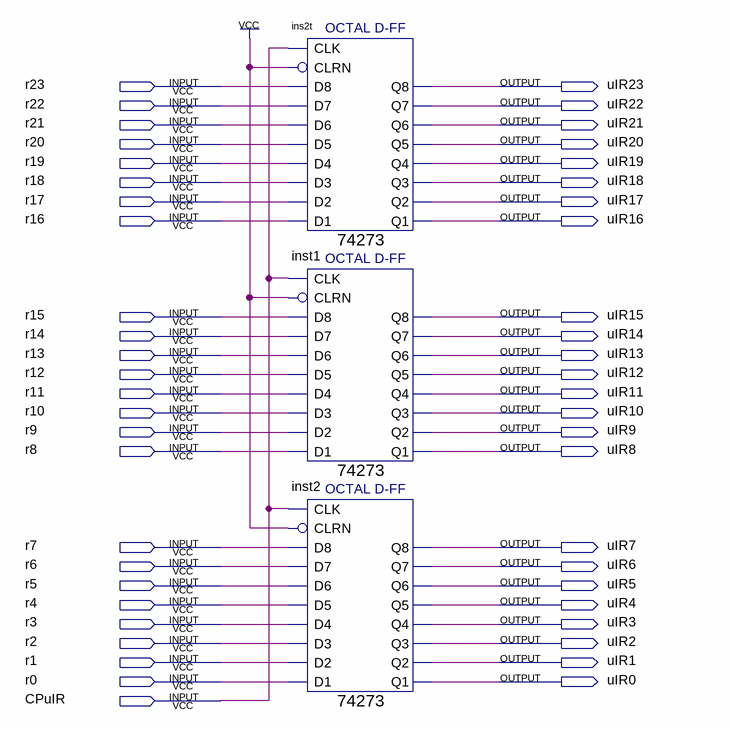
[diagram p0: schematic sheet]
// Quartus schematic uIR.bdf as structural Verilog: 3 symbols, 49 pins
module uIR (
  input  r23,
  input  r22,
  input  r21,
  input  r20,
  input  r19,
  input  r18,
  input  r17,
  input  r16,
  input  r15,
  input  r14,
  input  r13,
  input  r12,
  input  r11,
  input  r10,
  input  r9,
  input  r8,
  input  r7,
  input  r6,
  input  r5,
  input  r4,
  input  r3,
  input  r2,
  input  r1,
  input  r0,
  input  CPuIR,
  output uIR23,
  output uIR22,
  output uIR21,
  output uIR20,
  output uIR19,
  output uIR18,
  output uIR17,
  output uIR16,
  output uIR15,
  output uIR14,
  output uIR13,
  output uIR12,
  output uIR11,
  output uIR10,
  output uIR9,
  output uIR8,
  output uIR7,
  output uIR6,
  output uIR5,
  output uIR4,
  output uIR3,
  output uIR2,
  output uIR1,
  output uIR0
);

  \74273  ins2t (
    .D2(r17), .D3(r18), .D1(r16), .D4(r19), .D7(r22), .D6(r21), .D5(r20), .D8(r23), .CLK(CPuIR), .CLRN(1'b1),
    .Q4(uIR19), .Q1(uIR16), .Q2(uIR17), .Q3(uIR18), .Q6(uIR21), .Q5(uIR20), .Q7(uIR22), .Q8(uIR23));
  \74273  inst1 (
    .D2(r9), .D3(r10), .D1(r8), .D4(r11), .D7(r14), .D6(r13), .D5(r12), .D8(r15), .CLK(CPuIR), .CLRN(1'b1),
    .Q4(uIR11), .Q1(uIR8), .Q2(uIR9), .Q3(uIR10), .Q6(uIR13), .Q5(uIR12), .Q7(uIR14), .Q8(uIR15));
  \74273  inst2 (
    .D2(r1), .D3(r2), .D1(r0), .D4(r3), .D7(r6), .D6(r5), .D5(r4), .D8(r7), .CLK(CPuIR), .CLRN(1'b1),
    .Q4(uIR3), .Q1(uIR0), .Q2(uIR1), .Q3(uIR2), .Q6(uIR5), .Q5(uIR4), .Q7(uIR6), .Q8(uIR7));
endmodule
